# Altium schematic sheet [6]-KeyLed.SchDoc
size A4
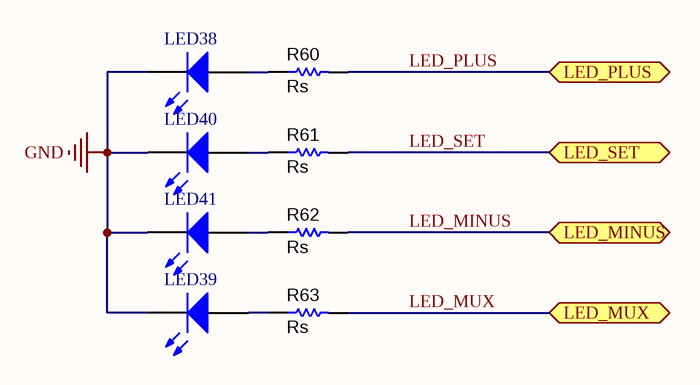
[diagram p0: [6]-KeyLed.SchDoc]

## Parts
LED38  LED  [LED-0603-YELLOW]  (value not drawn)
LED39  LED  [LED-0603-YELLOW]  (value not drawn)
LED40  LED  [LED-0603-YELLOW]  (value not drawn)
LED41  LED  [LED-0603-YELLOW]  (value not drawn)
R60  value Rs  [0603]  (hidden comment: CRCW06031K00FKEA)
R61  value Rs  [0603]  (hidden comment: CRCW06031K00FKEA)
R62  value Rs  [0603]  (hidden comment: CRCW06031K00FKEA)
R63  value Rs  [0603]  (hidden comment: CRCW06031K00FKEA)

## Ports
LED_MINUS (bidir), LED_MUX (bidir), LED_PLUS (bidir), LED_SET (bidir)

## Nets
GND: LED38.2(K) LED39.2(K) LED40.2(K) LED41.2(K)
LED_MINUS: R62.2 ; port LED_MINUS
LED_MUX: R63.2 ; port LED_MUX
LED_PLUS: R60.2 ; port LED_PLUS
LED_SET: R61.2 ; port LED_SET
NetLED38_1: LED38.1(A) R60.1
NetLED39_1: LED39.1(A) R63.1
NetLED40_1: LED40.1(A) R61.1
NetLED41_1: LED41.1(A) R62.1

## Notes on the sheet
- Title
- Size:
- Date:
- A4
- Number:
- Time:
- Revision:
- Sheet
- of
- File:

## Library data of the parts
LED38-LED41 = LED: Typical INFRARED GaAs LED; Published: 8-Jun-2000; LatestRevisionDate: 08-Jul-2005; LatestRevisionNote: Mech Layer 1 removed.; PackageReference: LED-0; Publisher: Altium Limited; PackageDescription: LED; 2 Leads
R60-R63 = R0603: RES, 1.00k ohm, 1%, 0.1W, 0603; Manufacturer: Vishay-Dale; Alternate Manufacturer: Any; Alternate PartNumber: Equivalent; CompType: Resistor; Res_ohm: 1000; Value_Code: 1k00; Tolerance_%: 1; Power_W: 0.1; VDC_V: 75; TempCo: 100 ppm/C; EIA_Code: E96; U/M: EA; SymbolVersion: 2009-05-29; PartNumber: CRCW06031K00FKEA; PackageReference: 0603; RoHS: Y; Value1: 1%; Value2: 0.1W; MountType: SMT; Technology: Thick Film; Published: 2008-06-26; Publisher: Texas Instruments; LatestRevisionDate: 2012-10-04; LatestRevisionNote: Changed publisher; ComponentLink1Description: Datasheet link; ComponentLink1URL: http://www.vishay.com/docs/20035/dcrcwe3.pdf; Supplier 1: Digi-Key; Supplier Part Number 1: 541-1.00KHCT-ND; Supplier 2: Farnell; Supplier Part Number 2: 1151593; Supplier 3: Newark; Supplier Part Number 3: 52K8015